# Altium schematic sheet SAR+ModDelta.SchDoc
size A
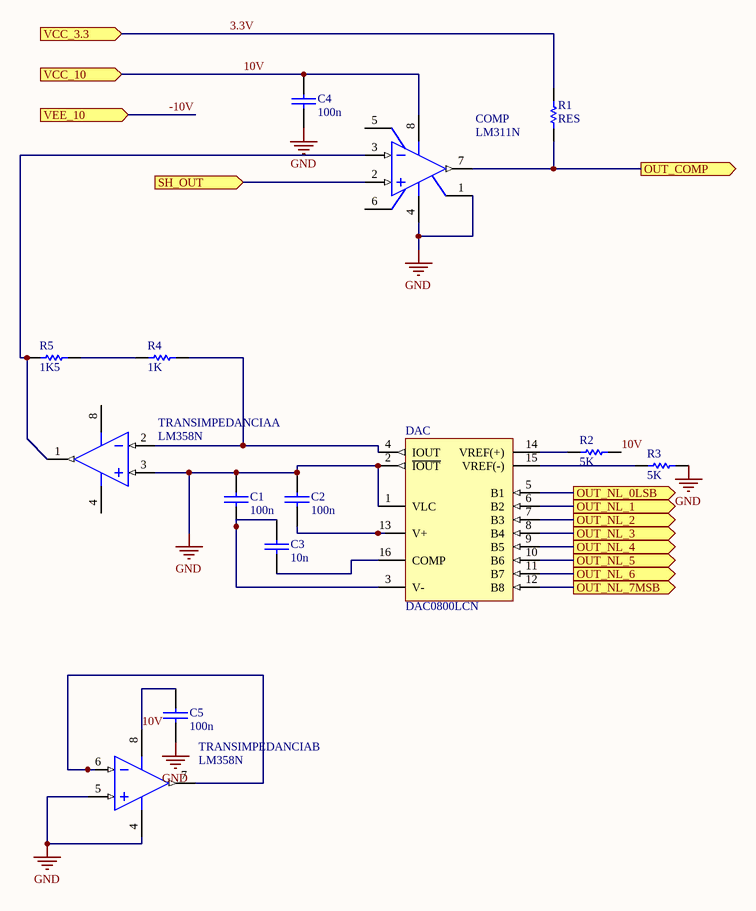
[diagram p0: SAR+ModDelta.SchDoc]

## Parts
C1  100n  [CAP100]
C2  100n  [CAP100]
C3  10n  [CAP100]
C4  100n  [CAP100]
C5  100n  [CAP100]
COMP  LM311N  [N08E]
DAC  DAC0800LCN  [N16E]
R1  RES  [RES400]
R2  5K  [RES400]
R3  5K  [RES400]
R4  1K  [RES400]
R5  1K5  [RES400]
TRANSIMPEDANCIA  LM358N  [N08E]  (parts A,B of 2)

## Ports
OUT_COMP (out), OUT_NL_0LSB (out), OUT_NL_1 (out), OUT_NL_2 (out), OUT_NL_3 (out), OUT_NL_4 (out), OUT_NL_5 (out), OUT_NL_6 (out), OUT_NL_7MSB (out), SH_OUT (in), VCC_3.3 (in), VCC_10 (in), VEE_10 (in)

## Nets
GND: C1.1 C2.1 C4.2 C5.2 COMP.1(GND) COMP.4(V-) DAC.1(VLC) DAC.2(~{IOUT}) R3.2 TRANSIMPEDANCIA.3(INA+) TRANSIMPEDANCIA.4(GND) TRANSIMPEDANCIA.5(INB+)
3.3V: R1.2 ; port VCC_3.3
10V: C4.1 C5.1 COMP.8(V+) R2.2 TRANSIMPEDANCIA.8(V+) ; port VCC_10
-10V: port VEE_10
OUT_COMP: COMP.7(OUT) R1.1 ; port OUT_COMP
OUT_NL_0LSB: DAC.5(B1) ; port OUT_NL_0LSB
OUT_NL_1: DAC.6(B2) ; port OUT_NL_1
OUT_NL_2: DAC.7(B3) ; port OUT_NL_2
OUT_NL_3: DAC.8(B4) ; port OUT_NL_3
OUT_NL_4: DAC.9(B5) ; port OUT_NL_4
OUT_NL_5: DAC.10(B6) ; port OUT_NL_5
OUT_NL_6: DAC.11(B7) ; port OUT_NL_6
OUT_NL_7MSB: DAC.12(B8) ; port OUT_NL_7MSB
SH_OUT: COMP.2(IN+) ; port SH_OUT
NetC1_2: C1.2 C3.1 DAC.3(V-)
NetC2_2: C2.2 DAC.13(V+)
NetC3_2: C3.2 DAC.16(COMP)
NetCOMP_3: COMP.3(IN-) R5.1 TRANSIMPEDANCIA.1(OUTA)
NetDAC_4: DAC.4(IOUT) R4.2 TRANSIMPEDANCIA.2(INA-)
NetDAC_14: DAC.14(VREF(+)) R2.1
NetDAC_15: DAC.15(VREF(-)) R3.1
NetR4_1: R4.1 R5.2
NetTRANSIMPEDANCIA_6: TRANSIMPEDANCIA.6(INB-) TRANSIMPEDANCIA.7(OUTB)

Not connected (* = marked no-connect by the designer): COMP 5(BAL) 6(BAL/STB)

## Library data of the parts
C1-C5 = CAP
COMP = LM311N: Voltage Comparator, 8-pin MDIP; Manufacturer: National Semiconductor; PackageTopMarking: NSUZXYTTE#*LM*311N; PowerWise: N; CompType: Amplifiers; Published: 4-Dec-2008; DatasheetVersion: Jan-2001; PackageVersion: revG, May-2006; PackageReference: N08E; Publisher: Altium Limited; PackageDescription: MDIP, .365 x .250 x .130in, 8 Lead, .100in Pitch; Supplier 1: Farnell; Supplier Part Number 1: 9487220; PartNumber: LM311N; RoHS: N; PinCount: 8; Code_JEDEC: MS-001-BA; ComponentLink1Description: LM311 Datasheet; ComponentLink1URL: http://www.national.com/ds/LM/LM311.pdf; ComponentLink2Description: LM311 Web Page; ComponentLink2URL: http://www.national.com/pf/LM/LM311.html; ComponentLink3Description: N08E Package Page; ComponentLink3URL: http://www.national.com/packaging/folders/n08e.html
DAC = DAC0800LCN: 8-Bit D/A Converter, 16-pin MDIP; Manufacturer: National Semiconductor; PackageTopMarking: NSUZXYYTTE#*DAC0800LCN*DAC-08EP; PowerWise: N; Published: 4-Dec-2008; DatasheetVersion: Sep-2006; PackageVersion: revG, May-2006; PackageReference: N16E; Publisher: Altium Limited; PackageDescription: MDIP, .750 x .250 x .130in, 16 Lead, .100in Pitch; Supplier 1: Farnell; Supplier Part Number 1: 9486640; PartNumber: DAC0800LCN; RoHS: N; PinCount: 16; CompType: D/A Converter; Code_JEDEC: MS-001-BB; ComponentLink1Description: DAC0800 Datasheet; ComponentLink1URL: http://www.national.com/ds/DA/DAC0800.pdf; ComponentLink2Description: DAC0800 Web Page; ComponentLink2URL: http://www.national.com/pf/DA/DAC0800.html; ComponentLink3Description: N16E Package Page; ComponentLink3URL: http://www.national.com/packaging/folders/n16e.html
R2-R5 = RES
TRANSIMPEDANCIA = LM358N: Low Power Dual Operational Amplifier, 8-pin MDIP; Manufacturer: National Semiconductor; PackageTopMarking: NSUZXYTTE#*LM*358N; PowerWise: N; CompType: Amplifiers; Published: 4-Dec-2008; LatestRevisionDate: 13-Jan-2009; LatestRevisionNote: Sim Model Added.; DatasheetVersion: Oct-2005; PackageVersion: revG, May-2006; PackageReference: N08E; Publisher: Altium Limited; PackageDescription: MDIP, .365 x .250 x .130in, 8 Lead, .100in Pitch; Supplier 1: Farnell; Supplier Part Number 1: 9486836; Supplier 2: Farnell; Supplier Part Number 2: 1523834; PartNumber: LM358N; RoHS: N; PinCount: 8; Code_JEDEC: MS-001-BA; ComponentLink1Description: LM358 Datasheet; ComponentLink1URL: http://www.national.com/ds/LM/LM358.pdf; ComponentLink2Description: LM358 Web Page; ComponentLink2URL: http://www.national.com/pf/LM/LM358.html; ComponentLink3Description: N08E Package Page; ComponentLink3URL: http://www.national.com/packaging/folders/n08e.html